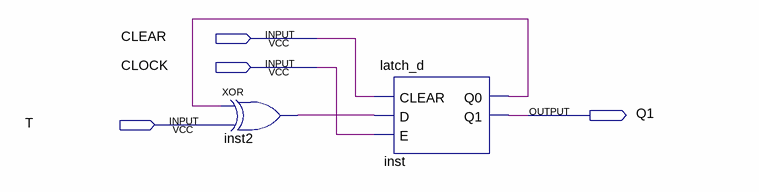
[diagram p0: schematic sheet]
// Quartus schematic flipflop_t.bdf as structural Verilog: 2 symbols, 4 pins
module flipflop_t (
  input  CLEAR,
  input  CLOCK,
  input  T,
  output Q1
);

  wire inst2_out, inst_q0;

  xor inst2 (inst2_out, inst_q0, T);
  latch_d inst (.CLEAR(CLEAR), .D(inst2_out), .E(CLOCK), .Q0(inst_q0), .Q1(Q1));
endmodule
